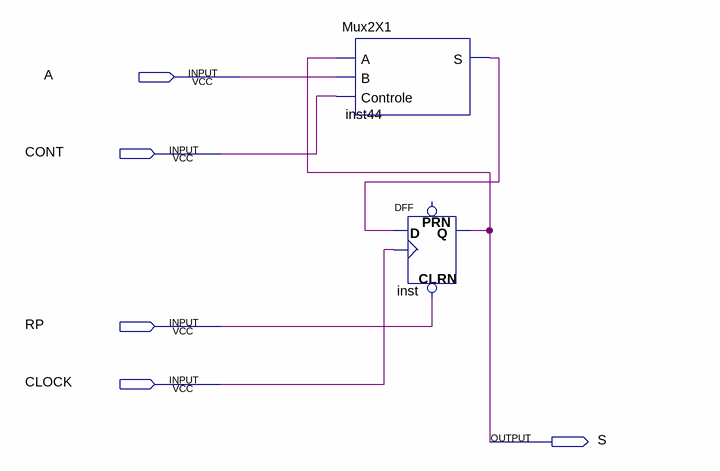
[diagram p0: schematic sheet]
// Quartus schematic REGISTRADOR1B1C.bdf as structural Verilog: 2 symbols, 5 pins
module REGISTRADOR1B1C (
  input  A,
  input  CONT,
  input  RP,
  input  CLOCK,
  output S
);

  wire inst44_s;

  Mux2X1 inst44 (.A(S), .B(A), .Controle(CONT), .S(inst44_s));
  DFF inst (.CLRN(RP), .CLK(CLOCK), .D(inst44_s), .Q(S));  // open: PRN
endmodule
